# Altium project QuadraticConverter.PrjPcb
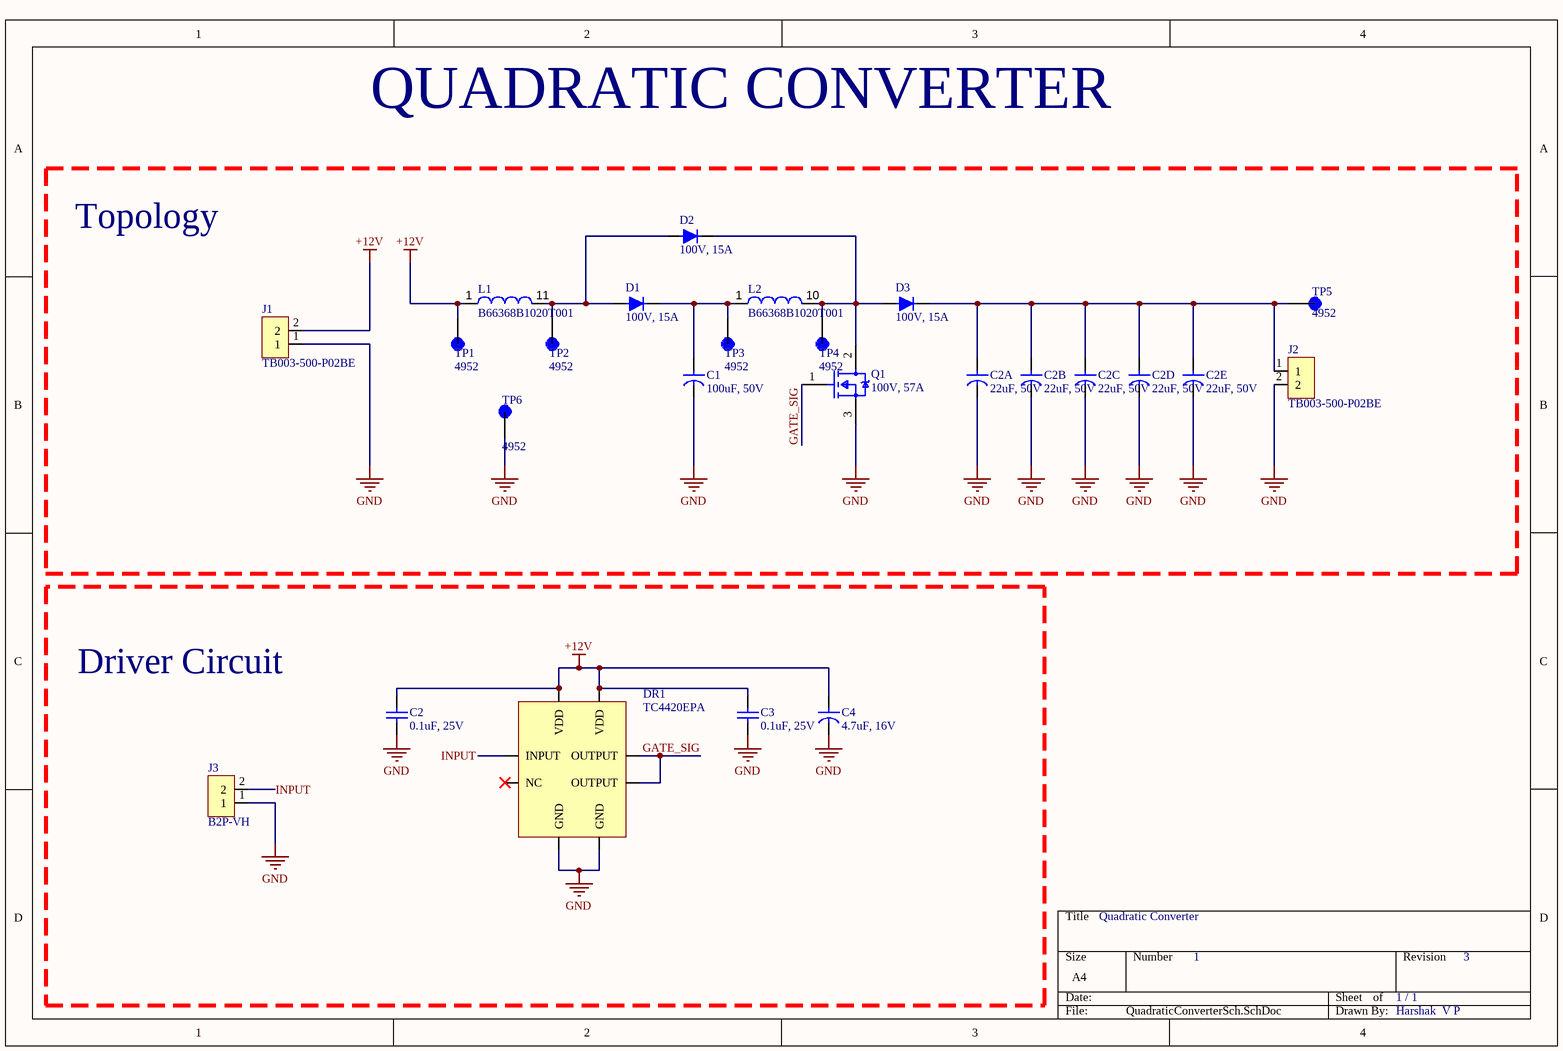
[diagram p0: QuadraticConverterSch.SchDoc]
1 sheet, 25 parts. Net scope: global (net labels, ports and power ports of the same name join across sheets).
Board file: QuadraticConverterPCB.PcbDoc

## Sheet QuadraticConverterSch.SchDoc
size A4; SheetNumber: 1; SheetTotal: 1

### Parts
C1  100uF, 50V  [CAP_G3]
C2  0.1uF, 25V  [CAP_CER]
C2A  22uF, 50V  [CAP_C3]
C2B  22uF, 50V  [CAP_C3]
C2C  22uF, 50V  [CAP_C3]
C2D  22uF, 50V  [CAP_C3]
C2E  22uF, 50V  [CAP_C3]
C3  0.1uF, 25V  [CAP_CER]
C4  4.7uF, 16V  [CAP_C3]
D1  100V, 15A  [TO-220AC_ONS]
D2  100V, 15A  [TO-220AC_ONS]
D3  100V, 15A  [TO-220AC_ONS]
DR1  TC4420EPA  [TC4420EPA]
J1  TB003-500-P02BE  [CUI_TB003-500-P02BE]
J2  TB003-500-P02BE  [CUI_TB003-500-P02BE]
J3  B2P-VH  [JST_B2P-VH(LF)(SN)]
L1  B66368B1020T001  [ETD49]
L2  B66368B1020T001  [ETD44]
Q1  100V, 57A  [FP-PG-TO220-3-MFG]
TP1  4952  [KEYSTONE_4952]
TP2  4952  [KEYSTONE_4952]
TP3  4952  [KEYSTONE_4952]
TP4  4952  [KEYSTONE_4952]
TP5  4952  [KEYSTONE_4952]
TP6  4952  [KEYSTONE_4952]

### Blocks framed on the sheet
Topology: C1 C2A C2B C2C C2D C2E D1-D3 J1 J2 L1 L2 Q1 TP1-TP6
Driver Circuit: C2-C4 DR1 J3

### Nets
+12V: C2.2 C3.2 C4.2 DR1.1(VDD) DR1.8(VDD) J1.2 L1.1 TP1.TP
GND: C1.1 C2.1 C2A.1 C2B.1 C2C.1 C2D.1 C2E.1 C3.1 C4.1 DR1.4(GND) DR1.5(GND) J1.1 J2.2 J3.1 Q1.3(S) TP6.TP
GATE_SIG: DR1.6(OUTPUT) DR1.7(OUTPUT) Q1.1(G)
INPUT: DR1.2(INPUT) J3.2
NetC1_2: C1.2 D1.2 L2.1 TP3.TP
NetC2A_2: C2A.2 C2B.2 C2C.2 C2D.2 C2E.2 D3.2 J2.1 TP5.TP
NetD1_1: D1.1 D2.1 L1.11 TP2.TP
NetD2_2: D2.2 D3.1 L2.10 Q1.2(D) TP4.TP

Not connected (* = marked no-connect by the designer): DR1 3(NC)*

### Notes on the sheet
- QUADRATIC CONVERTER
- Quadratic Converter
- 1
- 1 / 1
- 3
- Harshak  V P

### Library data of the parts
C1 = SK107M050AG3AAKPLP: CAP ALUM 100UF 20% 50V RADIAL TH; Manufacturer: Yageo Group; Supplier: DigiKey; Supplier Part Number: 399-6105-ND; Manufacturer Part Number: SK107M050AG3AAKPLP; Category: Aluminum Electrolytic Capacitors; Stock: 14220; Pricing: 1=0.35, 10=0.215, 50=0.1572, 100=0.1388, 500=0.10682, 1000=0.09673, 2500=0.08592, 5000=0.07933 (USD); Case/Package: Radial; RoHS: Non-Compliant; Tolerance: 20%; Voltage Rating (DC): 50V
C2 C3 = C320C104J3G5TA: CAP CER 0.1UF 25V C0G/NP0 RADIAL; Manufacturer: Yageo Group; Value: 100nF; Dielectric: C0G; Dielectric Material: Ceramic; Tolerance: 5%; Supplier: DigiKey; Supplier Part Number: C320C104J3G5TA-ND; Manufacturer Part Number: C320C104J3G5TA; RoHS: Compliant; Category: Ceramic Capacitors; Stock: 1448; Pricing: 1=0.95, 10=0.602, 50=0.4654, 100=0.4233, 500=0.35228, 1000=0.33033, 2500=0.30714, 5000=0.29317 (USD); Case/Package: Radial; China RoHS: Compliant; Height: 5.84mm; Length: 5.08mm; Lifecycle Status: Production; Max Operating Temperature: 125°C; Min Operating Temperature: -55°C; Mounting Technology: Through Hole; Number of Terminals: 2; Packaging: Bulk; REACH SVHC: Yes; Terminal Pitch: 2.54mm; Voltage Rating (DC): 25V; Width: 3.18mm; ComponentLink1URL: https://datasheet.octopart.com:443/C320C104J3G5TA-KEMET-datasheet-182049027.pdf?src-supplier=IHS; ComponentLink1Description: https://datasheet.octopart.com:443/C320C104J3G5TA-KEMET-datasheet-182049027.pdf?src-supplier=IHS
C2A C2B C2C C2D C2E = ESK226M050AC3FA: CAP ALUM 22UF 20% 50V RADIAL TH; Manufacturer: Yageo Group; Value: 22µF; Dissipation Factor: 10%; Leakage Current: 11µA; Ripple Current: 100mA; Supplier: DigiKey; Supplier Part Number: 399-ESK226M050AC3FATB-ND; Manufacturer Part Number: ESK226M050AC3FA; RoHS: Compliant; Category: Aluminum Electrolytic Capacitors; Stock: 7835; Pricing: 2000=0.04756, 4000=0.04333, 6000=0.04119, 10000=0.0388, 14000=0.0374, 20000=0.03605 (USD); Case/Package: Radial; Diameter: 5mm; Export Control Classification Number (ECCN) Code: EAR99; Height: 11mm; Harmonized Tariff Schedule (HTS) Code: 8532.22.00.20; Introduction Date: 2012-10-10; Lead Pitch: 5mm; Length: 11mm; Lifecycle Status: Production; Max Operating Temperature: 85°C; Min Operating Temperature: -40°C; Mounting Technology: Through Hole; Number of Terminals: 2; Radiation Hardening: No; REACH SVHC: Yes; Terminal Pitch: 2mm; Termination: Radial; Tolerance: 20%; Voltage Rating: 50V; Voltage Rating (DC): 50V; ComponentLink1URL: https://datasheet.octopart.com:443/ESK226M050AC3FA-KEMET-datasheet-182055911.pdf?src-supplier=IHS; ComponentLink1Description: https://datasheet.octopart.com:443/ESK226M050AC3FA-KEMET-datasheet-182055911.pdf?src-supplier=IHS; ComponentLink2URL: https://datasheet.octopart.com:443/ESK226M050AC3FA-KEMET-datasheet-130075539.pdf?src-supplier=Farnell; ComponentLink2Description: https://datasheet.octopart.com:443/ESK226M050AC3FA-KEMET-datasheet-130075539.pdf?src-supplier=Farnell
C4 = SK475M016AC3AAKPLP: CAP ALUM 4.7UF 20% 16V RADIAL TH; Manufacturer: Yageo Group; Supplier: DigiKey; Supplier Part Number: 399-ESK475M016AC3AA-ND; Manufacturer Part Number: SK475M016AC3AAKPLP; Category: Capacitors; Stock: 38051; Pricing: 1=0.2, 10=0.121, 50=0.0868, 100=0.0759, 500=0.05706, 1000=0.05109, 2500=0.04469, 5000=0.04078 (USD)
D1-D3 = MUR1520G: DIODE STANDARD 200V 15A TO2202; Manufacturer: onsemi; Manufacturer Lifecycle Status: ACTIVE; Element Configuration: Single; Forward Voltage: 1V; Max Forward Surge Current (Ifsm): 200A; Number of Elements: 1; Peak Reverse Current: 10µA; Recovery Time: 35ns; Supplier: DigiKey; Supplier Part Number: MUR1520GOS-ND; Manufacturer Part Number: MUR1520G; RoHS: Compliant; Category: Rectifier Diodes; Stock: 23366; Pricing: 1=2.82, 50=1.3934, 100=1.2551, 500=1.01232, 1000=0.9343, 2000=0.86872, 5000=0.841 (USD); Average Rectified Current: 15A; Breakdown Voltage: 200V; Case/Package: TO-220-2; China RoHS: Non-Compliant; Contact Plating: Tin; Country of Origin: Mainland China; Current Rating: 15A; Export Control Classification Number (ECCN) Code: EAR99; Forward Current: 15A; Height: 9.27mm; Harmonized Tariff Schedule (HTS) Code: 8541.10.00.80; Introduction Date: 1982-12-01; Lead Free: Lead Free; Length: 10.29mm; Lifecycle Status: Production; Max Operating Temperature: 175°C; Max Output current: 15A; Max Repetitive Reverse Voltage (Vrrm): 200V; Max Reverse Voltage (DC): 200V; Max Surge Current: 200A; Min Operating Temperature: -65°C; Pins: 2; Number of Terminals: 2; Output Current: 15A; Peak Non-Repetitive Surge Current: 200A; Polarity: Standard; Radiation Hardening: No; REACH SVHC: No; Reverse Recovery Time: 35ns; Reverse Standoff Voltage: 200V; Reverse Voltage: 200V; Schedule B: 8541100080, 8541100080|8541100080|8541100080|8541100080|8541100080|8541100080|8541100080|8541100080|8541100080|8541100080|8541100080|8541100080|8541100080|8541100080|8541100080|8541100080|8541100080|8541100080|8541100080|8541100080|8541100080|8541100080|8541100080|85; Voltage Rating (DC): 200V; Weight: 4.535924g; Width: 4.82mm; ComponentLink1URL: https://datasheet.octopart.com:443/MUR1520G-ON-Semiconductor-datasheet-11724209.pdf?src-supplier=Upverter; ComponentLink1Description: https://datasheet.octopart.com:443/MUR1520G-ON-Semiconductor-datasheet-11724209.pdf?src-supplier=Upverter; ComponentLink2URL: https://datasheet.octopart.com:443/MUR1520G-ON-Semiconductor-datasheet-555965.pdf?src-supplier=Upverter; ComponentLink2Description: https://datasheet.octopart.com:443/MUR1520G-ON-Semiconductor-datasheet-555965.pdf?src-supplier=Upverter; ComponentLink3URL: https://datasheet.octopart.com:443/MUR1520G-onsemi-datasheet-180964278.pdf?src-supplier=IHS; ComponentLink3Description: https://datasheet.octopart.com:443/MUR1520G-onsemi-datasheet-180964278.pdf?src-supplier=IHS; ComponentLink4URL: https://datasheet.octopart.com:443/MUR1520G-ON-Semiconductor-datasheet-42423355.pdf?src-supplier=onsemi; ComponentLink4Description: https://datasheet.octopart.com:443/MUR1520G-ON-Semiconductor-datasheet-42423355.pdf?src-supplier=onsemi; ComponentLink5URL: https://datasheet.octopart.com:443/MUR1520G-onsemi-datasheet-165623856.pdf?src-supplier=Newark; ComponentLink5Description: https://datasheet.octopart.com:443/MUR1520G-onsemi-datasheet-165623856.pdf?src-supplier=Newark; ComponentLink6URL: https://datasheet.octopart.com:443/MUR1520G-ON-Semiconductor-datasheet-21211048.pdf?src-supplier=Electro+Sonic; ComponentLink6Description: https://datasheet.octopart.com:443/MUR1520G-ON-Semiconductor-datasheet-21211048.pdf?src-supplier=Electro+Sonic; ComponentLink7URL: https://datasheet.octopart.com:443/MUR1520G-ON-Semiconductor-datasheet-14054755.pdf?src-supplier=iiiC; ComponentLink7Description: https://datasheet.octopart.com:443/MUR1520G-ON-Semiconductor-datasheet-14054755.pdf?src-supplier=iiiC; ComponentLink8URL: https://datasheet.octopart.com:443/MUR1520G-ON-Semiconductor-datasheet-9571269.pdf?src-supplier=RS+(Formerly+Allied+Electronics); ComponentLink8Description: https://datasheet.octopart.com:443/MUR1520G-ON-Semiconductor-datasheet-9571269.pdf?src-supplier=RS+(Formerly+Allied+Electronics); ComponentLink9URL: https://datasheet.octopart.com:443/MUR1520G-ON-Semiconductor-datasheet-7627526.pdf?src-supplier=Farnell; ComponentLink9Description: https://datasheet.octopart.com:443/MUR1520G-ON-Semiconductor-datasheet-7627526.pdf?src-supplier=Farnell; ComponentLink10URL: https://datasheet.octopart.com:443/MUR1520G-ON-Semiconductor-datasheet-8441531.pdf?src-supplier=Jameco+(USA); ComponentLink10Description: https://datasheet.octopart.com:443/MUR1520G-ON-Semiconductor-datasheet-8441531.pdf?src-supplier=Jameco+(USA); ComponentLink11URL: http://sigma.octopart.com:80/15540786/rohs_certificate/ON-Semiconductor-MUR1520G.pdf?src-supplier=Compliance+Statements; ComponentLink11Description: http://sigma.octopart.com:80/15540786/rohs_certificate/ON-Semiconductor-MUR1520G.pdf?src-supplier=Compliance+Statements; ComponentLink12URL: http://sigma.octopart.com:80/15680957/materials_sheet/ON-Semiconductor-MUR1520G.csv?src-supplier=Compliance+Statements; ComponentLink12Description: http://sigma.octopart.com:80/15680957/materials_sheet/ON-Semiconductor-MUR1520G.csv?src-supplier=Compliance+Statements; ComponentLink13URL: http://sigma.octopart.com:80/150620126/rohs_statement/ON-Semiconductor-MUR1520G.pdf?src-supplier=Compliance+Statements; ComponentLink13Description: http://sigma.octopart.com:80/150620126/rohs_statement/ON-Semiconductor-MUR1520G.pdf?src-supplier=Compliance+Statements; ComponentLink14URL: http://sigma.octopart.com:80/reach_statement/ON-Semiconductor-company-79.pdf?src-supplier=Compliance+Statements; ComponentLink14Description: http://sigma.octopart.com:80/reach_statement/ON-Semiconductor-company-79.pdf?src-supplier=Compliance+Statements; ComponentLink15URL: https://octopart.com:443/opatz8j6/c1?t=nt_GdgalfpOTzaWI7ooSredfzqB6ERBuWQiJbk27sNOQiFi2UUykZKCLTg_8AJU8vOyl0Z6-lA1IOIGVnNla633GCdxRaI8FqNM4p_QqzO77u5SPv-kBuN8S9R1qP1kntFUr0NBj3wgLTiEo0ltfRTRk3-m8hC6rBOPWQm9rIC7qbAIzBGY9xI7OF5uLdVcoejT1hvt5vD3sQuR5iwosmdghXKHvyZ8KOpfN0q1dfUwFFtv_P3rarqQqZMZjodj8Y17SuqAwV14et8d_cQUKk8ZQ0j94OefPwa4O_a4bdJ_F43H_t66x8xJRN7_6NkesPIxkdNds3dhLoBRhW0WTmNJG5myBDcO70Q&src-supplier=Compliance+Statements; ComponentLink15Description: https://octopart.com:443/opatz8j6/c1?t=nt_GdgalfpOTzaWI7ooSredfzqB6ERBuWQiJbk27sNOQiFi2UUykZKCLTg_8AJU8vOyl0Z6-lA1IOIGVnNla633GCdxRaI8FqNM4p_QqzO77u5SPv-kBuN8S9R1qP1kntFUr0NBj3wgLTiEo0ltfRTRk3-m8hC6rBOPWQm9rIC7qbAIzBGY9xI7OF5uLdVcoejT1hvt5vD3sQuR5iwosmdghXKHvyZ8KOpfN0q1dfUwFFtv_P3rarqQqZMZjodj8Y17SuqAwV14et8d_cQUKk8ZQ0j94OefPwa4O_a4bdJ_F43H_t66x8xJRN7_6NkesPIxkdNds3dhLoBRhW0WTmNJG5myBDcO70Q&src-supplier=Compliance+Statements; ComponentLink16URL: https://octopart.com:443/opatz8j6/c1?t=ObDvWLcOcBV6SK18OWCBN_Fzgrl2kjVkxJPnOso7YVKI6Bpibfs3Hkxu4loTLk37O5plQNQ8JhcCV1c5sAsowwvhgiEPheMSmu5i9VXjQYc7LjFJUWCzUFoeEaAjV7SQHu95bexkkenfZbwGIfHSpczXyh6z30q4p-VLEUsUlOc0_7-IsUtTlLR7aAAN9qG5GYN3XbpElLR67L8KuFMSkQFf94N3RdrK3odK857AU-rUZKnhOhLnFsNtkwSNNyktKUqOitdqwYO-n7msw0XDQRYfYe1AS5ii8G_jtGXkZ7xfLJVZKt5HWaaq3auLdGTk9VcQCZY-3_hJj7ka0TLYR8vFVpKapro-&src-supplier=Compliance+Statements; ComponentLink16Description: https://octopart.com:443/opatz8j6/c1?t=ObDvWLcOcBV6SK18OWCBN_Fzgrl2kjVkxJPnOso7YVKI6Bpibfs3Hkxu4loTLk37O5plQNQ8JhcCV1c5sAsowwvhgiEPheMSmu5i9VXjQYc7LjFJUWCzUFoeEaAjV7SQHu95bexkkenfZbwGIfHSpczXyh6z30q4p-VLEUsUlOc0_7-IsUtTlLR7aAAN9qG5GYN3XbpElLR67L8KuFMSkQFf94N3RdrK3odK857AU-rUZKnhOhLnFsNtkwSNNyktKUqOitdqwYO-n7msw0XDQRYfYe1AS5ii8G_jtGXkZ7xfLJVZKt5HWaaq3auLdGTk9VcQCZY-3_hJj7ka0TLYR8vFVpKapro-&src-supplier=Compliance+Statements
DR1 = TC4420EPA: IC GATE DRVR LOW-SIDE 8DIP; Manufacturer: Microchip; Manufacturer Lifecycle Status: REL; Fall Time: 35ns; Input Bias Current: 10µA; Max Output current: 6A; Max Power Dissipation: 730mW; Max Supply Current: 1.5mA; Max Supply Voltage: 18V; Min Supply Voltage: 4.5V; Nominal Supply Current: 3mA; Number of Channels: 1; Propagation Delay: 75ns; Supplier: DigiKey; Supplier Part Number: TC4420EPA-ND; Manufacturer Part Number: TC4420EPA; RoHS: Compliant; Category: Gate Drivers; Stock: 1439; Pricing: 1=2.02, 25=1.68, 100=1.53 (USD); Projected EOL Date: 2034-01-01; Case/Package: PDIP; Country of Assembly: Thailand; Country of Fabrication: United States of America; Country of Origin: Thailand; Export Control Classification Number (ECCN) Code: EAR99; Height: 3.683mm; HS Code: 8542.39.0090; Harmonized Tariff Schedule (HTS) Code: 8542.39.0060; Introduction Date: 2002-01-01; Lead Free: Lead Free; Length: 9.779mm; Lifecycle Status: Production; Max Operating Temperature: 150°C; Min Operating Temperature: -40°C; Mounting Technology: Through Hole; Number of Drivers: 1; Number of Outputs: 1; Pins: 8; Output Current: 6A; Output Voltage: 18V; Packaging: Bulk; Power Dissipation: 730mW; Radiation Hardening: No; REACH SVHC: No; Schedule B: 8542390000, 8542390000|8542390000|8542390000|8542390000|8542390000|8542390000|8542390000|8542390000|8542390000|8542390000|8542390000|8542390000|8542390000|8542390000|8542390000|8542390000|8542390000|8542390000|8542390000|8542390000|8542390000|8542390000|8542390000|85; Turn-On Delay Time: 75ns; Width: 6.6mm; ComponentLink1URL: https://datasheet.octopart.com:443/TC4420EPA-Microchip-datasheet-14710913.pdf?src-supplier=Microchip; ComponentLink1Description: https://datasheet.octopart.com:443/TC4420EPA-Microchip-datasheet-14710913.pdf?src-supplier=Microchip; ComponentLink2URL: https://datasheet.octopart.com:443/TC4420EPA-Microchip-datasheet-17724646.pdf?src-supplier=Microchip; ComponentLink2Description: https://datasheet.octopart.com:443/TC4420EPA-Microchip-datasheet-17724646.pdf?src-supplier=Microchip; ComponentLink3URL: https://datasheet.octopart.com:443/TC4420EPA-Microchip-datasheet-4888.pdf?src-supplier=Esaler+Electronic; ComponentLink3Description: https://datasheet.octopart.com:443/TC4420EPA-Microchip-datasheet-4888.pdf?src-supplier=Esaler+Electronic; ComponentLink4URL: https://datasheet.octopart.com:443/TC4420EPA-Microchip-datasheet-51278.pdf?src-supplier=element14; ComponentLink4Description: https://datasheet.octopart.com:443/TC4420EPA-Microchip-datasheet-51278.pdf?src-supplier=element14; ComponentLink5URL: https://datasheet.octopart.com:443/TC4420EPA-Microchip-datasheet-14156544.pdf?src-supplier=iiiC; ComponentLink5Description: https://datasheet.octopart.com:443/TC4420EPA-Microchip-datasheet-14156544.pdf?src-supplier=iiiC; ComponentLink6URL: http://sigma.octopart.com:80/188449171/materials_sheet/Microchip-TC4420EPA.pdf?src-supplier=Compliance+Statements; ComponentLink6Description: http://sigma.octopart.com:80/188449171/materials_sheet/Microchip-TC4420EPA.pdf?src-supplier=Compliance+Statements; ComponentLink7URL: http://sigma.octopart.com:80/189109226/materials_sheet/Microchip-TC4420EPA.pdf?src-supplier=Compliance+Statements; ComponentLink7Description: http://sigma.octopart.com:80/189109226/materials_sheet/Microchip-TC4420EPA.pdf?src-supplier=Compliance+Statements; ComponentLink8URL: http://sigma.octopart.com:80/rohs_statement/Microchip-company-71.pdf?src-supplier=Compliance+Statements; ComponentLink8Description: http://sigma.octopart.com:80/rohs_statement/Microchip-company-71.pdf?src-supplier=Compliance+Statements; ComponentLink9URL: http://sigma.octopart.com:80/reach_statement/Microchip-company-70.pdf?src-supplier=Compliance+Statements; ComponentLink9Description: http://sigma.octopart.com:80/reach_statement/Microchip-company-70.pdf?src-supplier=Compliance+Statements; ComponentLink10URL: http://sigma.octopart.com:80/conflict_mineral_statement/Microchip-company-69.pdf?src-supplier=Compliance+Statements; ComponentLink10Description: http://sigma.octopart.com:80/conflict_mineral_statement/Microchip-company-69.pdf?src-supplier=Compliance+Statements; ComponentLink11URL: http://sigma.octopart.com:80/conflict_mineral_statement/Microchip-company-68.pdf?src-supplier=Compliance+Statements; ComponentLink11Description: http://sigma.octopart.com:80/conflict_mineral_statement/Microchip-company-68.pdf?src-supplier=Compliance+Statements
J1 J2 = TB003-500-P02BE: TERMINAL BLOCK, SCREW TYPE, 5.00; Manufacturer: Same Sky; Approvals: CE, EN, IEC, UL, cUL; Current Rating: 10A; Number of Contacts: 2; Number of Levels: 1; Pitch: 5mm; Voltage Rating: 300V; Wire/Cable Gauge: 14AWG; Supplier: DigiKey; Supplier Part Number: 102-6161-ND; Manufacturer Part Number: TB003-500-P02BE; RoHS: Compliant; Category: Terminal Blocks; Stock: 17844; Pricing: 1=0.46, 10=0.345, 25=0.3008, 50=0.271, 100=0.2443, 250=0.21476, 500=0.19656, 1000=0.18166, 5000=0.15748 (USD); Color: Blue; Export Control Classification Number (ECCN) Code: EAR99; Height: 10.3mm; Harmonized Tariff Schedule (HTS) Code: 8536.90.40.00; Introduction Date: 2020-04-29; Lifecycle Status: Production; Max Operating Temperature: 105°C; Min Operating Temperature: -40°C; Mounting Technology: Screw; Pins: 2; Number of Rows: 1; Orientation: Horizontal; REACH SVHC: Yes; Width: 7.8mm; ComponentLink1URL: https://datasheet.octopart.com:443/TB003-500-P02BE-Same-Sky-datasheet-181920252.pdf?src-supplier=Same+Sky; ComponentLink1Description: https://datasheet.octopart.com:443/TB003-500-P02BE-Same-Sky-datasheet-181920252.pdf?src-supplier=Same+Sky; ComponentLink2URL: https://datasheet.octopart.com:443/TB003-500-P02BE-CUI-Devices-datasheet-175928135.pdf?src-supplier=Same+Sky; ComponentLink2Description: https://datasheet.octopart.com:443/TB003-500-P02BE-CUI-Devices-datasheet-175928135.pdf?src-supplier=Same+Sky; ComponentLink3URL: https://datasheet.octopart.com:443/TB003-500-P02BE-CUI-Devices-datasheet-144794942.pdf?src-supplier=Same+Sky; ComponentLink3Description: https://datasheet.octopart.com:443/TB003-500-P02BE-CUI-Devices-datasheet-144794942.pdf?src-supplier=Same+Sky; ComponentLink4URL: https://datasheet.octopart.com:443/TB003-500-P02BE-CUI-Devices-datasheet-180438473.pdf?src-supplier=IHS; ComponentLink4Description: https://datasheet.octopart.com:443/TB003-500-P02BE-CUI-Devices-datasheet-180438473.pdf?src-supplier=IHS; ComponentLink5URL: https://datasheet.octopart.com:443/TB003-500-P02BE-Same-Sky-datasheet-182881442.pdf?src-supplier=Electro+Sonic; ComponentLink5Description: https://datasheet.octopart.com:443/TB003-500-P02BE-Same-Sky-datasheet-182881442.pdf?src-supplier=Electro+Sonic; ComponentLink6URL: https://datasheet.octopart.com:443/TB003-500-P02BE-CUI-Devices-datasheet-154730745.pdf?src-supplier=Electro+Sonic; ComponentLink6Description: https://datasheet.octopart.com:443/TB003-500-P02BE-CUI-Devices-datasheet-154730745.pdf?src-supplier=Electro+Sonic; ComponentLink7URL: https://datasheet.octopart.com:443/TB003-500-P02BE-CUI-Devices-datasheet-175927968.pdf?src-supplier=CUI+Devices+SCT; ComponentLink7Description: https://datasheet.octopart.com:443/TB003-500-P02BE-CUI-Devices-datasheet-175927968.pdf?src-supplier=CUI+Devices+SCT; ComponentLink8URL: https://datasheet.octopart.com:443/TB003-500-P02BE-CUI-Devices-datasheet-142371916.pdf?src-supplier=Future+Electronics; ComponentLink8Description: https://datasheet.octopart.com:443/TB003-500-P02BE-CUI-Devices-datasheet-142371916.pdf?src-supplier=Future+Electronics; ComponentLink9URL: https://datasheet.octopart.com:443/TB003-500-P02BE-Same-Sky-datasheet-182050248.pdf?src-supplier=Future+Electronics; ComponentLink9Description: https://datasheet.octopart.com:443/TB003-500-P02BE-Same-Sky-datasheet-182050248.pdf?src-supplier=Future+Electronics; ComponentLink10URL: https://datasheet.octopart.com:443/TB003-500-P02BE-CUI-Devices-datasheet-175928502.pdf?src-supplier=Future+Electronics; ComponentLink10Description: https://datasheet.octopart.com:443/TB003-500-P02BE-CUI-Devices-datasheet-175928502.pdf?src-supplier=Future+Electronics; ComponentLink11URL: https://datasheet.octopart.com:443/TB003-500-P02BE-CUI-Devices-datasheet-147843963.pdf?src-supplier=Future+Electronics; ComponentLink11Description: https://datasheet.octopart.com:443/TB003-500-P02BE-CUI-Devices-datasheet-147843963.pdf?src-supplier=Future+Electronics; ComponentLink12URL: https://datasheet.octopart.com:443/TB003-500-P02BE-Same-Sky-datasheet-192927514.pdf?src-supplier=Farnell; ComponentLink12Description: https://datasheet.octopart.com:443/TB003-500-P02BE-Same-Sky-datasheet-192927514.pdf?src-supplier=Farnell; ComponentLink13URL: https://datasheet.octopart.com:443/TB003-500-P02BE-Same-Sky-datasheet-189105712.pdf?src-supplier=Master+Electronics; ComponentLink13Description: https://datasheet.octopart.com:443/TB003-500-P02BE-Same-Sky-datasheet-189105712.pdf?src-supplier=Master+Electronics; ComponentLink14URL: https://octopart.com:443/opatz8j6/c1?t=pbRrR8Hown2rNkVW0S8igVE_zX_UDxh2yuhjoaL4SVF8qKqKIwCYm4Fz_63SpfVbHTSjgp2FPk7eWU64rwPfysKzEu6m9WTnDufD3WULoQj8qmTMYcw1T_Jxq8CgGgAeYbtumj8RnE-nQ44eRRASlAuXrEJAw0TDzeW2uga5hAVfbA7ekW4jmAHoRtmgp9LceGZscb2UZZ7RRGYE1eI9grKucljF36dHIQx6tfCRbX81GhsOrkIl40vqTJa7wb75IjU4gjKsmpf-ElFo98BWlHE7zezmoIdESkww1H-5lw78vaCadrJKZ8FFRghawO__SmUHA1yKaaBHUYuSk38crXBniFW9eiQJnXGsQpPoo9vx&src-supplier=Compliance+Statements; ComponentLink14Description: https://octopart.com:443/opatz8j6/c1?t=pbRrR8Hown2rNkVW0S8igVE_zX_UDxh2yuhjoaL4SVF8qKqKIwCYm4Fz_63SpfVbHTSjgp2FPk7eWU64rwPfysKzEu6m9WTnDufD3WULoQj8qmTMYcw1T_Jxq8CgGgAeYbtumj8RnE-nQ44eRRASlAuXrEJAw0TDzeW2uga5hAVfbA7ekW4jmAHoRtmgp9LceGZscb2UZZ7RRGYE1eI9grKucljF36dHIQx6tfCRbX81GhsOrkIl40vqTJa7wb75IjU4gjKsmpf-ElFo98BWlHE7zezmoIdESkww1H-5lw78vaCadrJKZ8FFRghawO__SmUHA1yKaaBHUYuSk38crXBniFW9eiQJnXGsQpPoo9vx&src-supplier=Compliance+Statements; ComponentLink15URL: https://octopart.com:443/opatz8j6/c1?t=-SNXZaHrxqMDz5PNpKBuJacicwKaO02awKHcIcFMFp2JeGq7ATnNAfO9H0ZZYbTaXiT1NlcIYD89FwSQil1u9-sg6zmUZUQ9zRnCq4qst7FeelPUsDTT-t78a2cmfQTZH6aEmsUCowfT9y4kgfgIwOg3z9HuT7VheZB6a42Y8HDteIjLSP3jqiKEvmfPagzurkHX6dmvJiZ5RVNXTMtylXKoEXILRr0yjg21icMTlobIgPTIsN01EXLtrTky1kQp6BHUt4BI7NuaUk30_EmRvpfCHb4hhPtwLLD3RyC-5BKOz8I3jvM7dRrdWYwbSAD4DyB2Giai_85phNPU5bK39QAOU1GizIxua7Ys8oA&src-supplier=Compliance+Statements; ComponentLink15Description: https://octopart.com:443/opatz8j6/c1?t=-SNXZaHrxqMDz5PNpKBuJacicwKaO02awKHcIcFMFp2JeGq7ATnNAfO9H0ZZYbTaXiT1NlcIYD89FwSQil1u9-sg6zmUZUQ9zRnCq4qst7FeelPUsDTT-t78a2cmfQTZH6aEmsUCowfT9y4kgfgIwOg3z9HuT7VheZB6a42Y8HDteIjLSP3jqiKEvmfPagzurkHX6dmvJiZ5RVNXTMtylXKoEXILRr0yjg21icMTlobIgPTIsN01EXLtrTky1kQp6BHUt4BI7NuaUk30_EmRvpfCHb4hhPtwLLD3RyC-5BKOz8I3jvM7dRrdWYwbSAD4DyB2Giai_85phNPU5bK39QAOU1GizIxua7Ys8oA&src-supplier=Compliance+Statements; ComponentLink16URL: https://octopart.com:443/opatz8j6/c1?t=jCDYcJYxeNP8z66HUgntQVBpJ9xIs-U1uKu0nCgoiP9aYHllnADfv7VacDL9eqwPAQzUPuYDwfQzXUd1BHed-BlME4xL6apKbrlLQ75a7iI9_Tz4hp6csKkIsjZDwQk4oX3PcUPzKOJYygpfFmJaIKX3dcvKCETBNvy2oqGLf2KePHH7skPGpsFA7EBnHAB9yNVcyzVjpArndLTNx6mUm64k7hE2xH58W5b1vPXIWhod6lNBGE83zJsaulFcpj3HKkDU9LJTWNw8dExn4YZUoeyNW73E3WI-P272TKcfCKK3bpOqj_xCdpNm2uWXk4BBaOnxahDtwfkNG8nUqAd1Ka9ZZnwbT9gRcXDfwDAikAOz&src-supplier=Compliance+Statements; ComponentLink16Description: https://octopart.com:443/opatz8j6/c1?t=jCDYcJYxeNP8z66HUgntQVBpJ9xIs-U1uKu0nCgoiP9aYHllnADfv7VacDL9eqwPAQzUPuYDwfQzXUd1BHed-BlME4xL6apKbrlLQ75a7iI9_Tz4hp6csKkIsjZDwQk4oX3PcUPzKOJYygpfFmJaIKX3dcvKCETBNvy2oqGLf2KePHH7skPGpsFA7EBnHAB9yNVcyzVjpArndLTNx6mUm64k7hE2xH58W5b1vPXIWhod6lNBGE83zJsaulFcpj3HKkDU9LJTWNw8dExn4YZUoeyNW73E3WI-P272TKcfCKK3bpOqj_xCdpNm2uWXk4BBaOnxahDtwfkNG8nUqAd1Ka9ZZnwbT9gRcXDfwDAikAOz&src-supplier=Compliance+Statements; ComponentLink17URL: https://octopart.com:443/opatz8j6/c1?t=e9oIxIL9DKrn39utCRXSP0WpfM9nAdP3aQXODQNq5gnh0tUJF51OfImLVmRYwI1FqOL_DduMCh2jkJIvB1ywDLDmMZ4txkECLEI70u0MdDNMlxoQH7430hIkMP_uqnfQ5EP4b96CSEXf5d5kCBV_Pb0PJJfInlwKI_aThFtIoDsc0eNEA62ZU_ZYO2EcCsVg5pXUHhNcolVLZnuEb9aL2rx4PRkAQQlbnSI2Mj7Cf4yKRzXWr2iqUzzKFVtZ87rkPRjL9qI6Rx3Ouc0FSVcN3d6_i9V8GC5bEv_0anDtTN5j0wsuLSq8MWO5Xw4Vxm1ihfYNLwPViD36gGtqLA2dEicNGExL7AnEs1GSHgo&src-supplier=Compliance+Statements; ComponentLink17Description: https://octopart.com:443/opatz8j6/c1?t=e9oIxIL9DKrn39utCRXSP0WpfM9nAdP3aQXODQNq5gnh0tUJF51OfImLVmRYwI1FqOL_DduMCh2jkJIvB1ywDLDmMZ4txkECLEI70u0MdDNMlxoQH7430hIkMP_uqnfQ5EP4b96CSEXf5d5kCBV_Pb0PJJfInlwKI_aThFtIoDsc0eNEA62ZU_ZYO2EcCsVg5pXUHhNcolVLZnuEb9aL2rx4PRkAQQlbnSI2Mj7Cf4yKRzXWr2iqUzzKFVtZ87rkPRjL9qI6Rx3Ouc0FSVcN3d6_i9V8GC5bEv_0anDtTN5j0wsuLSq8MWO5Xw4Vxm1ihfYNLwPViD36gGtqLA2dEicNGExL7AnEs1GSHgo&src-supplier=Compliance+Statements
J3 = B2P-VH: CONN HEADER VERT 2POS 3.96MM; Manufacturer: JST; Connector Type: Male Pin; Gender: Male; Number of Contacts: 2; Pitch: 3.9624mm; Supplier: DigiKey; Supplier Part Number: 455-1639-ND; Manufacturer Part Number: B2P-VH; RoHS: Compliant; Category: Headers and Wire Housings; Stock: 25519; Pricing: 1=0.15, 10=0.132, 100=0.1117, 500=0.09968, 1000=0.09491, 5000=0.08471, 10000=0.08067 (USD); Color: Natural; Contact Material: Brass; Contact Mating Length: 7.6962mm; Contact Plating: Lead, Tin; Fastening Type: Friction; Housing Color: Natural; Housing Material: Nylon; Lead Free: Contains Lead; Lead Pitch: 3.96mm; Lifecycle Status: Obsolete; Mounting Technology: Through Hole; Pins: 2; Number of Positions: 2; Number of Rows: 1; Orientation: Straight; Packaging: Bulk; Terminal Pitch: 3.96mm; Termination: Solder; ComponentLink1URL: https://datasheet.octopart.com:443/B2P-VH-JST-datasheet-151658475.pdf?src-supplier=IHS; ComponentLink1Description: https://datasheet.octopart.com:443/B2P-VH-JST-datasheet-151658475.pdf?src-supplier=IHS; ComponentLink2URL: https://datasheet.octopart.com:443/B2P-VH-JST-datasheet-12510509.pdf?src-supplier=TME; ComponentLink2Description: https://datasheet.octopart.com:443/B2P-VH-JST-datasheet-12510509.pdf?src-supplier=TME; ComponentLink3URL: https://datasheet.octopart.com:443/B2P-VH-JST-datasheet-123795.pdf?src-supplier=DigiKey; ComponentLink3Description: https://datasheet.octopart.com:443/B2P-VH-JST-datasheet-123795.pdf?src-supplier=DigiKey
L1 = B66368B1020T001: BOBBIN COIL FORMER ETD 49X25X16; Manufacturer: EPCOS; Material: Plastic; Supplier: DigiKey; Supplier Part Number: 495-5489-ND; Manufacturer Part Number: B66368B1020T001; RoHS: Compliant; Category: Transformers; Stock: 3903; Pricing: 1=3.28, 10=2.256, 25=1.9196, 60=1.62833, 120=1.41583, 300=1.17707 (USD); Introduction Date: 2022-10-10; Lifecycle Status: Production; Pins: 20; REACH SVHC: No; ComponentLink1URL: https://datasheet.octopart.com:443/B66368B1020T001-EPCOS-datasheet-140090560.pdf?src-supplier=Ciiva; ComponentLink1Description: https://datasheet.octopart.com:443/B66368B1020T001-EPCOS-datasheet-140090560.pdf?src-supplier=Ciiva; ComponentLink2URL: https://datasheet.octopart.com:443/B66368B1020T001-EPCOS-datasheet-62119527.pdf?src-supplier=Newark; ComponentLink2Description: https://datasheet.octopart.com:443/B66368B1020T001-EPCOS-datasheet-62119527.pdf?src-supplier=Newark; ComponentLink3URL: https://datasheet.octopart.com:443/B66368B1020T001-EPCOS-datasheet-38086279.pdf?src-supplier=Newark; ComponentLink3Description: https://datasheet.octopart.com:443/B66368B1020T001-EPCOS-datasheet-38086279.pdf?src-supplier=Newark; ComponentLink4URL: https://datasheet.octopart.com:443/B66368B1020T001-EPCOS-datasheet-13702173.pdf?src-supplier=element14+APAC; ComponentLink4Description: https://datasheet.octopart.com:443/B66368B1020T001-EPCOS-datasheet-13702173.pdf?src-supplier=element14+APAC; ComponentLink5URL: https://datasheet.octopart.com:443/B66368B1020T001-EPCOS-datasheet-118216544.pdf?src-supplier=TME; ComponentLink5Description: https://datasheet.octopart.com:443/B66368B1020T001-EPCOS-datasheet-118216544.pdf?src-supplier=TME
L2 = B66366B1018T001: BOBBIN COIL FORMER ETD 44X22X15; Manufacturer: EPCOS; Material: PET; Supplier: DigiKey; Supplier Part Number: 495-5481-ND; Manufacturer Part Number: B66366B1018T001; RoHS: Compliant; Category: Uncategorized; Stock: 961; Pricing: 1=3.51, 10=2.41, 25=2.0492, 50=1.799, 100=1.5667, 250=1.28364, 500=1.27316 (USD); Lifecycle Status: Production; Pins: 18; REACH SVHC: No; ComponentLink1URL: https://datasheet.octopart.com:443/B66366B1018T001-EPCOS-datasheet-140090559.pdf?src-supplier=Ciiva; ComponentLink1Description: https://datasheet.octopart.com:443/B66366B1018T001-EPCOS-datasheet-140090559.pdf?src-supplier=Ciiva; ComponentLink2URL: https://datasheet.octopart.com:443/B66366B1018T001-EPCOS-datasheet-62119526.pdf?src-supplier=Newark; ComponentLink2Description: https://datasheet.octopart.com:443/B66366B1018T001-EPCOS-datasheet-62119526.pdf?src-supplier=Newark; ComponentLink3URL: https://datasheet.octopart.com:443/B66366B1018T001-EPCOS-datasheet-38086269.pdf?src-supplier=Newark; ComponentLink3Description: https://datasheet.octopart.com:443/B66366B1018T001-EPCOS-datasheet-38086269.pdf?src-supplier=Newark; ComponentLink4URL: https://datasheet.octopart.com:443/B66366B1018T001-EPCOS-datasheet-11601330.pdf?src-supplier=element14+APAC; ComponentLink4Description: https://datasheet.octopart.com:443/B66366B1018T001-EPCOS-datasheet-11601330.pdf?src-supplier=element14+APAC
Q1 = IRF3710PBF: MOSFET N-CH 100V 57A TO220AB; Manufacturer: Infineon; Drain to Source Resistance: 23mΩ; Element Configuration: Single; Fall Time: 47ns; Gate to Source Voltage (Vgs): 20V; Input Capacitance: 3.13nF; Max Junction Temperature (Tj): 175°C; Max Power Dissipation: 150W; Nominal Vgs: 4V; Number of Channels: 1; Power Dissipation: 200W; Recovery Time: 220ns; Value: 23MΩ; Rise Time: 58ns; Turn-Off Delay Time: 45ns; Turn-On Delay Time: 12ns; Supplier: DigiKey; Supplier Part Number: IRF3710PBF-ND; Manufacturer Part Number: IRF3710PBF; RoHS: Compliant; Category: MOSFETs; Stock: 1406; Pricing: 1=2.4, 10=1.537, 100=1.0446, 500=0.83386, 1000=0.76609, 2000=0.70911, 5000=0.64748, 10000=0.61425 (USD); Case/Package: TO-220AB; Continuous Drain Current (ID): 57A; Country of Origin: Mainland China; Current Rating: 57A; Drain to Source Breakdown Voltage: 100V; Drain to Source Voltage (Vdss): 100V; Dual Supply Voltage: 100V; Export Control Classification Number (ECCN) Code: EAR99; Height: 19.8mm; Harmonized Tariff Schedule (HTS) Code: 8541.29.00.95; Introduction Date: 1997-07-15; Lead Free: Lead Free; Lead Pitch: 2.54mm; Length: 10.54mm; Lifecycle Status: Production; Max Operating Temperature: 175°C; Min Breakdown Voltage: 100V; Min Operating Temperature: -55°C; Mounting Technology: Through Hole; Number of Elements: 1; Pins: 3; Number of Terminals: 3; On-State Resistance: 23mΩ; Package Quantity: 1000; Packaging: Bulk; Radiation Hardening: No; Rds On Max: 23mΩ; REACH SVHC: Yes; Schedule B: 8541290080, 8541290080|8541290080|8541290080|8541290080|8541290080|8541290080, 8541290080|8541290080|8541290080|8541290080|8541290080|8541290080|8541290080, 8541290080|8541290080|8541290080|8541290080|8541290080|8541290080|8541290080|8541290080|8541290080|8541290080|8541290080|8541290080|8541290080|8541290080|8541290080|8541290080; Termination: Through Hole; Threshold Voltage: 4V; Voltage Rating (DC): 100V; Width: 4.69mm; ComponentLink1URL: https://datasheet.octopart.com:443/IRF3710PBF-Infineon-datasheet-165061528.pdf?src-supplier=element14+APAC; ComponentLink1Description: https://datasheet.octopart.com:443/IRF3710PBF-Infineon-datasheet-165061528.pdf?src-supplier=element14+APAC; ComponentLink2URL: https://datasheet.octopart.com:443/IRF3710PBF-Infineon-datasheet-10898114.pdf?src-supplier=Newark; ComponentLink2Description: https://datasheet.octopart.com:443/IRF3710PBF-Infineon-datasheet-10898114.pdf?src-supplier=Newark; ComponentLink3URL: https://datasheet.octopart.com:443/IRF3710PBF-Infineon-datasheet-8398991.pdf?src-supplier=IHS; ComponentLink3Description: https://datasheet.octopart.com:443/IRF3710PBF-Infineon-datasheet-8398991.pdf?src-supplier=IHS; ComponentLink4URL: https://datasheet.octopart.com/IRF3710PBF-Infineon-datasheet-8332893.pdf; ComponentLink4Description: https://datasheet.octopart.com/IRF3710PBF-Infineon-datasheet-8332893.pdf; ComponentLink5URL: https://datasheet.octopart.com:443/IRF3710PBF-Infineon-datasheet-6396635.pdf?src-supplier=Verical; ComponentLink5Description: https://datasheet.octopart.com:443/IRF3710PBF-Infineon-datasheet-6396635.pdf?src-supplier=Verical; ComponentLink6URL: https://datasheet.octopart.com:443/IRF3710PBF-International-Rectifier-datasheet-20347.pdf?src-supplier=Sierra+IC; ComponentLink6Description: https://datasheet.octopart.com:443/IRF3710PBF-International-Rectifier-datasheet-20347.pdf?src-supplier=Sierra+IC; ComponentLink7URL: https://datasheet.octopart.com:443/IRF3710PBF-International-Rectifier-datasheet-14061907.pdf?src-supplier=iiiC; ComponentLink7Description: https://datasheet.octopart.com:443/IRF3710PBF-International-Rectifier-datasheet-14061907.pdf?src-supplier=iiiC; ComponentLink8URL: https://datasheet.octopart.com:443/IRF3710-International-Rectifier-datasheet-10739949.pdf?src-supplier=iiiC; ComponentLink8Description: https://datasheet.octopart.com:443/IRF3710-International-Rectifier-datasheet-10739949.pdf?src-supplier=iiiC; ComponentLink9URL: https://datasheet.octopart.com:443/IRF3710PBF-Infineon-datasheet-9663198.pdf?src-supplier=RS+(Formerly+Allied+Electronics); ComponentLink9Description: https://datasheet.octopart.com:443/IRF3710PBF-Infineon-datasheet-9663198.pdf?src-supplier=RS+(Formerly+Allied+Electronics); ComponentLink10URL: https://datasheet.octopart.com:443/IRF3710-International-Rectifier-datasheet-14407.pdf?src-supplier=RS+(Formerly+Allied+Electronics); ComponentLink10Description: https://datasheet.octopart.com:443/IRF3710-International-Rectifier-datasheet-14407.pdf?src-supplier=RS+(Formerly+Allied+Electronics); ComponentLink11URL: https://datasheet.octopart.com:443/IRF3710PBF-International-Rectifier-datasheet-8209083.pdf?src-supplier=Jameco+(USA); ComponentLink11Description: https://datasheet.octopart.com:443/IRF3710PBF-International-Rectifier-datasheet-8209083.pdf?src-supplier=Jameco+(USA); ComponentLink12URL: https://datasheet.octopart.com:443/IRF3710PBF-International-Rectifier-datasheet-5334727.pdf?src-supplier=Farnell; ComponentLink12Description: https://datasheet.octopart.com:443/IRF3710PBF-International-Rectifier-datasheet-5334727.pdf?src-supplier=Farnell; ComponentLink13URL: https://datasheet.octopart.com:443/IRF3710PBF-International-Rectifier-datasheet-64300.pdf?src-supplier=DigiKey; ComponentLink13Description: https://datasheet.octopart.com:443/IRF3710PBF-International-Rectifier-datasheet-64300.pdf?src-supplier=DigiKey; ComponentLink14URL: http://sigma.octopart.com:80/conflict_mineral_statement/Infineon-company-51.pdf?src-supplier=Compliance+Statements; ComponentLink14Description: http://sigma.octopart.com:80/conflict_mineral_statement/Infineon-company-51.pdf?src-supplier=Compliance+Statements; ComponentLink15URL: http://sigma.octopart.com:80/reach_statement/International-Rectifier-company-55.pdf?src-supplier=Compliance+Statements; ComponentLink15Description: http://sigma.octopart.com:80/reach_statement/International-Rectifier-company-55.pdf?src-supplier=Compliance+Statements; ComponentLink16URL: http://sigma.octopart.com:80/rohs_statement/International-Rectifier-company-54.pdf?src-supplier=Compliance+Statements; ComponentLink16Description: http://sigma.octopart.com:80/rohs_statement/International-Rectifier-company-54.pdf?src-supplier=Compliance+Statements
TP1-TP6 = 4952: PC TEST POINT LOOP; Manufacturer: Keystone; Body Material: Brass; Hole Diameter: 2.4892mm; Supplier: DigiKey; Supplier Part Number: 36-4952-ND; Manufacturer Part Number: 4952; RoHS: Compliant; Category: Test Points; Stock: 87839; Pricing: 1=0.25, 10=0.189, 25=0.1688, 100=0.1428, 500=0.11824, 1000=0.10924, 2500=0.1, 5000=0.09143 (USD); Contact Material: Brass; Contact Plating: Tin; Country of Origin: USA; Export Control Classification Number (ECCN) Code: EAR99; Height: 11.303mm; Introduction Date: 2009-07-02; Lead Free: Lead Free; Lifecycle Status: Production; Material: Brass; Pins: 1; Packaging: Bulk; REACH SVHC: Yes; Thickness: 635µm; Width: 2.9972mm; ComponentLink1URL: https://datasheet.octopart.com:443/4952-Keystone-datasheet-180506708.pdf?src-supplier=IHS; ComponentLink1Description: https://datasheet.octopart.com:443/4952-Keystone-datasheet-180506708.pdf?src-supplier=IHS; ComponentLink2URL: https://datasheet.octopart.com:443/4952-Keystone-datasheet-15715008.pdf?src-supplier=Future+Electronics; ComponentLink2Description: https://datasheet.octopart.com:443/4952-Keystone-datasheet-15715008.pdf?src-supplier=Future+Electronics; ComponentLink3URL: https://datasheet.octopart.com:443/4952-Keystone-datasheet-110725615.pdf?src-supplier=Future+Electronics; ComponentLink3Description: https://datasheet.octopart.com:443/4952-Keystone-datasheet-110725615.pdf?src-supplier=Future+Electronics; ComponentLink4URL: https://datasheet.octopart.com:443/4952-Keystone-datasheet-15685916.pdf?src-supplier=Sager+Electronics; ComponentLink4Description: https://datasheet.octopart.com:443/4952-Keystone-datasheet-15685916.pdf?src-supplier=Sager+Electronics; ComponentLink5URL: https://datasheet.octopart.com:443/4952-Keystone-datasheet-9145.pdf?src-supplier=element14; ComponentLink5Description: https://datasheet.octopart.com:443/4952-Keystone-datasheet-9145.pdf?src-supplier=element14; ComponentLink6URL: https://datasheet.octopart.com:443/4952-Keystone-datasheet-66657057.pdf?src-supplier=TME; ComponentLink6Description: https://datasheet.octopart.com:443/4952-Keystone-datasheet-66657057.pdf?src-supplier=TME; ComponentLink7URL: https://datasheet.octopart.com:443/4952-Keystone-datasheet-50495.pdf?src-supplier=DigiKey; ComponentLink7Description: https://datasheet.octopart.com:443/4952-Keystone-datasheet-50495.pdf?src-supplier=DigiKey

## Assembly variants
Prototype: all parts fitted